# Altium schematic sheet Archimedes_Thermistor_Kati.SchDoc: Thermistör Katı Tasarımı
size A4; DrawnBy: Emre Rasim; DocumentNumber: 5; Revision: 1.0; SheetNumber: 7; SheetTotal: 7; Sematikicerigi: Thermistör Katı Tasarımı
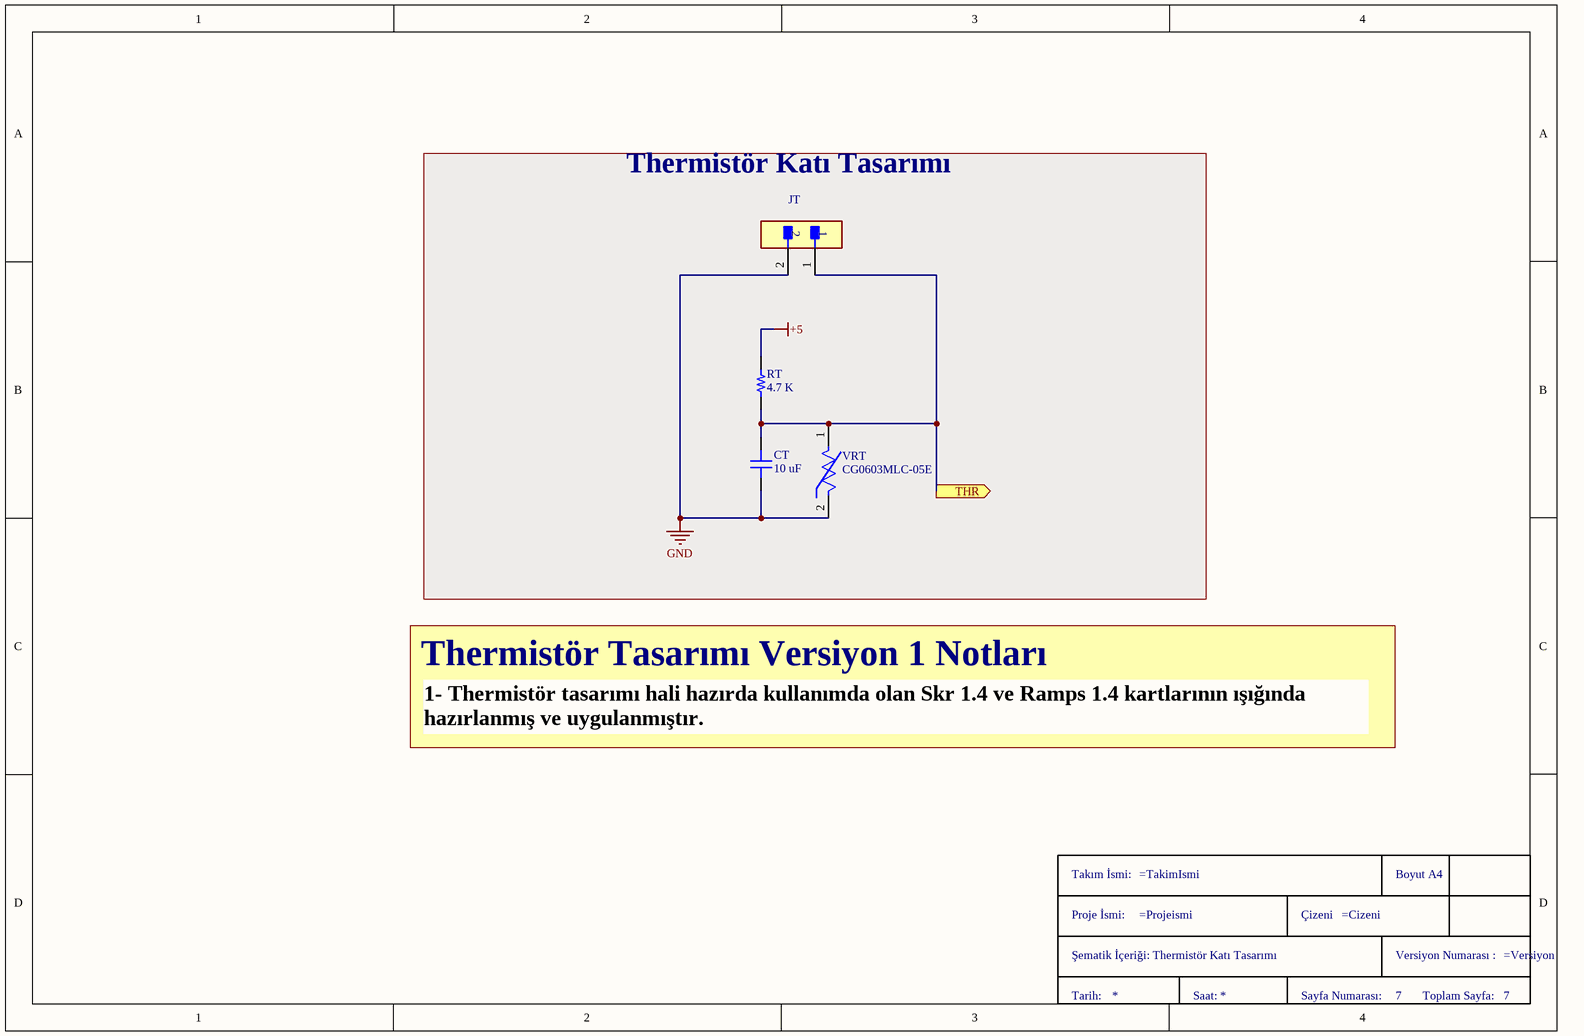
[diagram p0: Archimedes_Thermistor_Kati.SchDoc]

## Parts
CT  10 uF  [CAP 1206/3216]
JT  Con_2.5mm_2 lead_Female locked connector for 3d printer  [Con_2lead_2.5mm_3d_printer]  (value not drawn)
RT  4.7 K  [RES 0805/2012]
TitleBlock-A4  TitleBlock-A4  (value not drawn)  (graphical)
VRT  CG0603MLC-05E  [VR_Varistor_0603_CG0603MLC-05E]

## Blocks framed on the sheet
Thermistör Katı Tasarımı: CT JT RT VRT

## Ports
THR (out)

## Nets
+5: RT.2
GND: CT.1 JT.2 VRT.2
THR: CT.2 JT.1 RT.1 VRT.1 ; port THR

## Notes on the sheet
- Thermistör Tasarımı Versiyon 1 Notları
- 1- Thermistör tasarımı hali hazırda kullanımda olan Skr 1.4 ve Ramps 1.4 kartlarının ışığında hazırlanmış ve uygulanmıştır.
- (in symbol TitleBlock-A4) Takım İsmi:; Boyut A4; Proje İsmi:; Çizeni; Şematik İçeriği:; Versiyon Numarası :; Tarih:; Saat:; Sayfa Numarası:; Toplam Sayfa:

## Library data of the parts
CT = Capacitor 1206: 10 uF  and 50 Volt Ceramic Capacitor 1206 pack with X5R rating
RT = Resistor 805: 4.7 K ohm Resistor  with 805 pack and %1 tolerance rating
TitleBlock-A4 = TitleBlock-A4: Title Block for İTU eklemeli imalat takımı
VRT = VR_0603_CG0603MLC-05E: Varistor with 5v voltage and 0603 package - CG0603MLC-05E